# Altium schematic sheet servox15_layout_board.SchDoc
size A4
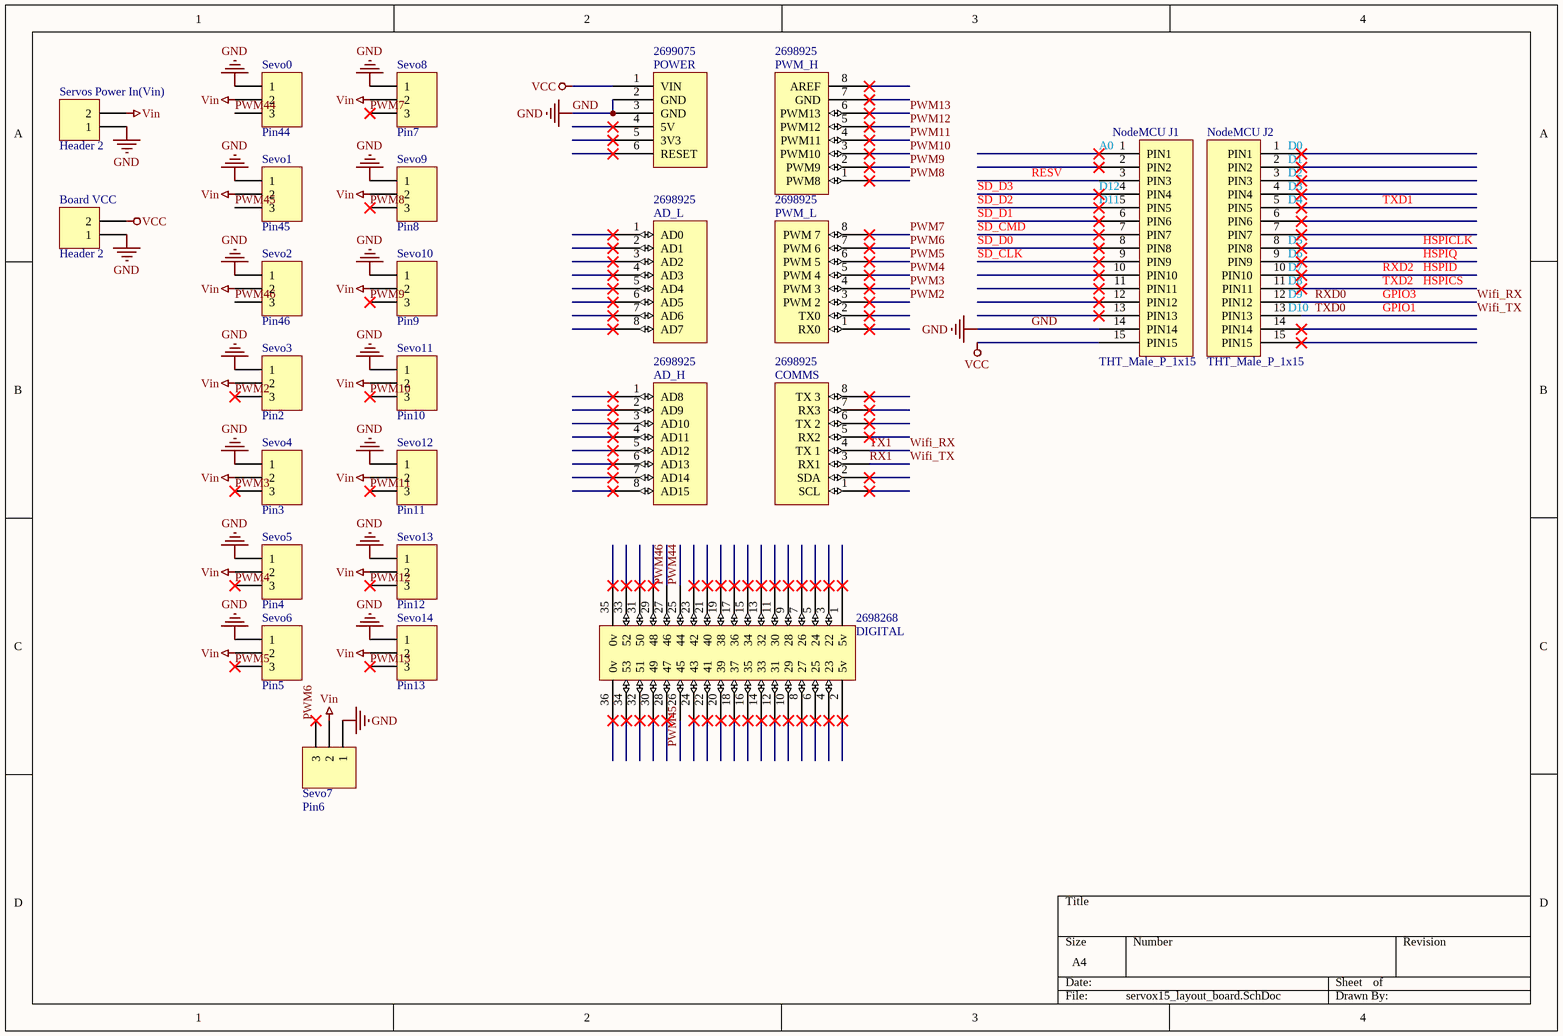
[diagram p0: servox15_layout_board.SchDoc]

## Parts
AD_H  Supplier Part Number 4: 2698925  [Header 8x1 8.5mm]  (hidden comment: AD_H)
AD_L  Supplier Part Number 5: 2698925  [Header 8x1 8.5mm]  (hidden comment: AD_L)
Board_VCC  Header 2  [HDR1X2]
COMMS  Supplier Part Number 4: 2698925  [Header 8x1 8.5mm]  (hidden comment: Communication)
DIGITAL  Supplier Part Number 5: 2698268  [HEADER 36X 8MM]  (hidden comment: IO_36)
NodeMCU_J1  THT_Male_P_1x15  [THT_Male_P_1x15-2.54mm]
NodeMCU_J2  THT_Male_P_1x15  [THT_Male_P_1x15-2.54mm]
POWER  Supplier Part Number 2: 2699075  [Header 6x1 8.5mm]  (hidden comment: POWER)
PWM_H  Supplier Part Number 4: 2698925  [Header 8x1 8.5mm]  (hidden comment: PWM_H)
PWM_L  Supplier Part Number 4: 2698925  [Header 8x1 8.5mm]  (hidden comment: PWM_L)
Servos_Power_In(Vin)  Header 2  [HDR1X2]
Sevo0  Pin44  [HDR1X3]
Sevo1  Pin45  [HDR1X3]
Sevo2  Pin46  [HDR1X3]
Sevo3  Pin2  [HDR1X3]
Sevo4  Pin3  [HDR1X3]
Sevo5  Pin4  [HDR1X3]
Sevo6  Pin5  [HDR1X3]
Sevo7  Pin6  [HDR1X3]
Sevo8  Pin7  [HDR1X3]
Sevo9  Pin8  [HDR1X3]
Sevo10  Pin9  [HDR1X3]
Sevo11  Pin10  [HDR1X3]
Sevo12  Pin11  [HDR1X3]
Sevo13  Pin12  [HDR1X3]
Sevo14  Pin13  [HDR1X3]

## Nets
GND: Board_VCC.1 NodeMCU_J1.14(PIN14) POWER.2(GND) POWER.3(GND) Servos_Power_In(Vin).1 Sevo0.1 Sevo1.1 Sevo2.1 Sevo3.1 Sevo4.1 Sevo5.1 Sevo6.1 Sevo7.1 Sevo8.1 Sevo9.1 Sevo10.1 Sevo11.1 Sevo12.1 Sevo13.1 Sevo14.1
VCC: Board_VCC.2 NodeMCU_J1.15(PIN15) POWER.1(VIN)
Vin: Servos_Power_In(Vin).2 Sevo0.2 Sevo1.2 Sevo2.2 Sevo3.2 Sevo4.2 Sevo5.2 Sevo6.2 Sevo7.2 Sevo8.2 Sevo9.2 Sevo10.2 Sevo11.2 Sevo12.2 Sevo13.2 Sevo14.2
PWM2: PWM_L.3(PWM_2) Sevo3.3
PWM3: PWM_L.4(PWM_3) Sevo4.3
PWM4: PWM_L.5(PWM_4) Sevo5.3
PWM5: PWM_L.6(PWM_5) Sevo6.3
PWM6: PWM_L.7(PWM_6) Sevo7.3
PWM7: PWM_L.8(PWM_7) Sevo8.3
PWM8: PWM_H.1(PWM8) Sevo9.3
PWM9: PWM_H.2(PWM9) Sevo10.3
PWM10: PWM_H.3(PWM10) Sevo11.3
PWM11: PWM_H.4(PWM11) Sevo12.3
PWM12: PWM_H.5(PWM12) Sevo13.3
PWM13: PWM_H.6(PWM13) Sevo14.3
PWM44: DIGITAL.25(44) Sevo0.3
PWM45: DIGITAL.26(45) Sevo1.3
PWM46: DIGITAL.27(46) Sevo2.3
RX1: COMMS.3(RX1) NodeMCU_J2.13(PIN13)  [also labelled TXD0, Wifi_TX]
RXD0: COMMS.4(TX_1) NodeMCU_J2.12(PIN12)  [also labelled TX1, Wifi_RX]

Not connected (* = marked no-connect by the designer): AD_H 1(AD8)* 2(AD9)* 3(AD10)* 4(AD11)* 5(AD12)* 6(AD13)* 7(AD14)* 8(AD15)*; AD_L 1(AD0)* 2(AD1)* 3(AD2)* 4(AD3)* 5(AD4)* 6(AD5)* 7(AD6)* 8(AD7)*; COMMS 1(SCL)* 2(SDA)* 5(RX2)* 6(TX_2)* 7(RX3)* 8(TX_3)*; DIGITAL 1(5v)* 2(5v)* 3(22)* 4(23)* 5(24)* 6(25)* 7(26)* 8(27)* 9(28)* 10(29)* 11(30)* 12(31)* 13(32)* 14(33)* 15(34)* 16(35)* 17(36)* 18(37)* 19(38)* 20(39)* 21(40)* 22(41)* 23(42)* 24(43)* 28(47)* 29(48)* 30(49)* 31(50)* 32(51)* 33(52)* 34(53)* 35(0v)* 36(0v)*; NodeMCU_J1 1(PIN1)* 2(PIN2)* 3(PIN3) 4(PIN4)* 5(PIN5)* 6(PIN6)* 7(PIN7)* 8(PIN8)* 9(PIN9)* 10(PIN10)* 11(PIN11)* 12(PIN12)* 13(PIN13)*; NodeMCU_J2 1(PIN1)* 2(PIN2)* 3(PIN3)* 4(PIN4)* 5(PIN5)* 6(PIN6)* 7(PIN7)* 8(PIN8)* 9(PIN9)* 10(PIN10)* 11(PIN11)* 14(PIN14)* 15(PIN15)*; POWER 4(5V)* 5(3V3)* 6(RESET)*; PWM_H 7(GND)* 8(AREF)*; PWM_L 1(RX0)* 2(TX0)*

## Notes on the sheet
- RESV
- (near NodeMCU_J1) A0
- (near NodeMCU_J2) D0
- (near NodeMCU_J2) D1
- (near NodeMCU_J2) D2
- SD_D0
- SD_CMD
- SD_D1
- SD_D3
- SD_D2
- (near NodeMCU_J1) D12
- (near NodeMCU_J1) D11
- (near NodeMCU_J2) D3
- (near NodeMCU_J2) D4
- (near NodeMCU_J2) D5
- TXD1
- HSPICLK
- SD_CLK
- (near NodeMCU_J2) D6
- (near NodeMCU_J2) D7
- (near NodeMCU_J2) D8
- (near NodeMCU_J2) D9
- (near NodeMCU_J2) D10
- TXD2
- RXD2
- GPIO3
- GPIO1
- HSPIQ
- HSPID
- HSPICS

## Library data of the parts
Board_VCC Servos_Power_In(Vin) = Header 2: Header, 2-Pin; LatestRevisionDate: 17-Jul-2002; LatestRevisionNote: Re-released for DXP Platform.; Publisher: Altium Limited
NodeMCU_J1 NodeMCU_J2 = THT_Male_P_1x15: THT Male pin header strip 1x15
Sevo0-Sevo14 = Header 3: Header, 3-Pin; LatestRevisionDate: 17-Jul-2002; LatestRevisionNote: Re-released for DXP Platform.; Publisher: Altium Limited
AD_H = AD_H: Supplier 1: Arrow; Supplier Part Number 1: 2698940; Supplier 2: Arrow; Supplier Part Number 2: 2698939; Supplier 3: Digi-Key; Supplier Part Number 3: SAM1198-08-ND; Supplier 4: Arrow
AD_L = AD_L: Supplier 1: Digi-Key; Supplier Part Number 1: SAM1198-08-ND; Supplier 2: Arrow; Supplier Part Number 2: 2698939; Supplier 3: Arrow; Supplier Part Number 3: 2698940; Supplier 4: Arrow; Supplier Part Number 4: 43085273; Supplier 5: Arrow
COMMS = Communication: Supplier 1: Digi-Key; Supplier Part Number 1: SAM1198-08-ND; Supplier 2: Arrow; Supplier Part Number 2: 2698940; Supplier 3: Arrow; Supplier Part Number 3: 2698939; Supplier 4: Arrow
DIGITAL = IO_36: Supplier 1: Digi-Key; Supplier Part Number 1: SAM1196-18-ND; Supplier 2: Arrow; Supplier Part Number 2: 48117090; Supplier 3: Arrow; Supplier Part Number 3: 46093326; Supplier 4: Arrow; Supplier Part Number 4: 2698278; Supplier 5: Arrow
POWER = POWER: Supplier 1: Arrow; Supplier Part Number 1: 52553843; Supplier 2: Arrow; Supplier 3: Digi-Key; Supplier Part Number 3: SAM1198-06-ND; Supplier 4: Arrow; Supplier Part Number 4: 2699089; Supplier 5: Arrow; Supplier Part Number 5: 2699088
PWM_H = PWM_H: Supplier 1: Digi-Key; Supplier Part Number 1: SAM1198-08-ND; Supplier 2: Arrow; Supplier Part Number 2: 2698940; Supplier 3: Arrow; Supplier Part Number 3: 2698939; Supplier 4: Arrow
PWM_L = PWM_L: Supplier 1: Arrow; Supplier Part Number 1: 2698940; Supplier 2: Arrow; Supplier Part Number 2: 2698939; Supplier 3: Digi-Key; Supplier Part Number 3: SAM1198-08-ND; Supplier 4: Arrow